# Altium schematic sheet PressurePulse_Pulse-PCB_Master.SchDoc
size B; SheetNumber: 1; SheetTotal: 15
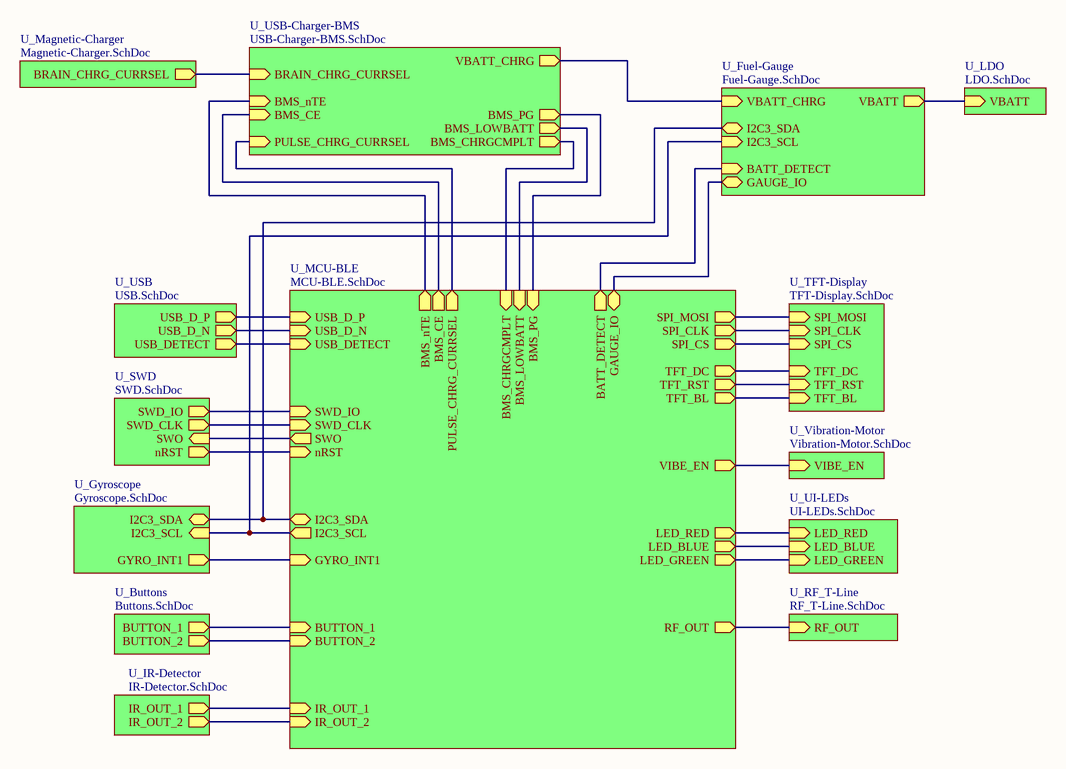
[diagram p0: PressurePulse_Pulse-PCB_Master.SchDoc]

## Sub-sheets
U_Buttons = Buttons.SchDoc: BUTTON_1 (out), BUTTON_2 (out)
U_Fuel-Gauge = Fuel-Gauge.SchDoc: I2C3_SCL (in), I2C3_SDA (bidir), GAUGE_IO (bidir), BATT_DETECT (in), VBATT (out), VBATT_CHRG (in)
U_Gyroscope = Gyroscope.SchDoc: I2C3_SDA (bidir), GYRO_INT1 (out), I2C3_SCL (in)
U_IR-Detector = IR-Detector.SchDoc: IR_OUT_1 (out), IR_OUT_2 (out)
U_LDO = LDO.SchDoc: VBATT (in)
U_Magnetic-Charger = Magnetic-Charger.SchDoc: BRAIN_CHRG_CURRSEL (out)
U_MCU-BLE = MCU-BLE.SchDoc: SWO (out), SWD_CLK (in), SWD_IO (in), nRST (in), USB_D_N (in), USB_D_P (in), I2C3_SCL (out), I2C3_SDA (bidir), BMS_PG (in), BMS_LOWBATT (in), BMS_CHRGCMPLT (in), BMS_nTE (out), BMS_CE (out), GAUGE_IO (bidir), BATT_DETECT (out), VIBE_EN (out), PULSE_CHRG_CURRSEL (out), GYRO_INT1 (in), USB_DETECT (in), SPI_CLK (out), SPI_MOSI (out), SPI_CS (out), TFT_RST (out), TFT_DC (out), TFT_BL (out), BUTTON_1 (in), BUTTON_2 (in), LED_RED (out), LED_BLUE (out), RF_OUT (out), LED_GREEN (out), IR_OUT_1 (in), IR_OUT_2 (in)
U_RF_T-Line = RF_T-Line.SchDoc: RF_OUT (in)
U_SWD = SWD.SchDoc: nRST (out), SWD_IO (out), SWD_CLK (out), SWO (in)
U_TFT-Display = TFT-Display.SchDoc: SPI_MOSI (in), SPI_CLK (in), SPI_CS (in), TFT_DC (in), TFT_RST (in), TFT_BL (in)
U_UI-LEDs = UI-LEDs.SchDoc: LED_RED (in), LED_BLUE (in), LED_GREEN (in)
U_USB = USB.SchDoc: USB_D_N (out), USB_D_P (out), USB_DETECT (out)
U_USB-Charger-BMS = USB-Charger-BMS.SchDoc: BMS_PG (out), BMS_LOWBATT (out), BMS_CHRGCMPLT (out), BMS_nTE (in), BMS_CE (in), PULSE_CHRG_CURRSEL (in), BRAIN_CHRG_CURRSEL (in), VBATT_CHRG (out)
U_Vibration-Motor = Vibration-Motor.SchDoc: VIBE_EN (in)

## Nets
(unnamed): sheet U_USB/USB_D_N, sheet U_MCU-BLE/USB_D_N
(unnamed): sheet U_USB/USB_D_P, sheet U_MCU-BLE/USB_D_P
(unnamed): sheet U_USB/USB_DETECT, sheet U_MCU-BLE/USB_DETECT
(unnamed): sheet U_USB-Charger-BMS/BMS_PG, sheet U_MCU-BLE/BMS_PG
(unnamed): sheet U_USB-Charger-BMS/BMS_LOWBATT, sheet U_MCU-BLE/BMS_LOWBATT
(unnamed): sheet U_USB-Charger-BMS/BMS_CHRGCMPLT, sheet U_MCU-BLE/BMS_CHRGCMPLT
(unnamed): sheet U_USB-Charger-BMS/BMS_nTE, sheet U_MCU-BLE/BMS_nTE
(unnamed): sheet U_USB-Charger-BMS/BMS_CE, sheet U_MCU-BLE/BMS_CE
(unnamed): sheet U_USB-Charger-BMS/PULSE_CHRG_CURRSEL, sheet U_MCU-BLE/PULSE_CHRG_CURRSEL
(unnamed): sheet U_USB-Charger-BMS/BRAIN_CHRG_CURRSEL, sheet U_Magnetic-Charger/BRAIN_CHRG_CURRSEL
(unnamed): sheet U_USB-Charger-BMS/VBATT_CHRG, sheet U_Fuel-Gauge/VBATT_CHRG
(unnamed): sheet U_Fuel-Gauge/I2C3_SCL, sheet U_MCU-BLE/I2C3_SCL, sheet U_Gyroscope/I2C3_SCL
(unnamed): sheet U_Fuel-Gauge/I2C3_SDA, sheet U_MCU-BLE/I2C3_SDA, sheet U_Gyroscope/I2C3_SDA
(unnamed): sheet U_Fuel-Gauge/GAUGE_IO, sheet U_MCU-BLE/GAUGE_IO
(unnamed): sheet U_Fuel-Gauge/BATT_DETECT, sheet U_MCU-BLE/BATT_DETECT
(unnamed): sheet U_Fuel-Gauge/VBATT, sheet U_LDO/VBATT
(unnamed): sheet U_SWD/nRST, sheet U_MCU-BLE/nRST
(unnamed): sheet U_SWD/SWD_IO, sheet U_MCU-BLE/SWD_IO
(unnamed): sheet U_SWD/SWD_CLK, sheet U_MCU-BLE/SWD_CLK
(unnamed): sheet U_SWD/SWO, sheet U_MCU-BLE/SWO
(unnamed): sheet U_MCU-BLE/VIBE_EN, sheet U_Vibration-Motor/VIBE_EN
(unnamed): sheet U_MCU-BLE/GYRO_INT1, sheet U_Gyroscope/GYRO_INT1
(unnamed): sheet U_MCU-BLE/SPI_CLK, sheet U_TFT-Display/SPI_CLK
(unnamed): sheet U_MCU-BLE/SPI_MOSI, sheet U_TFT-Display/SPI_MOSI
(unnamed): sheet U_MCU-BLE/SPI_CS, sheet U_TFT-Display/SPI_CS
(unnamed): sheet U_MCU-BLE/TFT_RST, sheet U_TFT-Display/TFT_RST
(unnamed): sheet U_MCU-BLE/TFT_DC, sheet U_TFT-Display/TFT_DC
(unnamed): sheet U_MCU-BLE/TFT_BL, sheet U_TFT-Display/TFT_BL
(unnamed): sheet U_MCU-BLE/BUTTON_1, sheet U_Buttons/BUTTON_1
(unnamed): sheet U_MCU-BLE/BUTTON_2, sheet U_Buttons/BUTTON_2
(unnamed): sheet U_MCU-BLE/LED_RED, sheet U_UI-LEDs/LED_RED
(unnamed): sheet U_MCU-BLE/LED_BLUE, sheet U_UI-LEDs/LED_BLUE
(unnamed): sheet U_MCU-BLE/RF_OUT, sheet U_RF_T-Line/RF_OUT
(unnamed): sheet U_MCU-BLE/LED_GREEN, sheet U_UI-LEDs/LED_GREEN
(unnamed): sheet U_MCU-BLE/IR_OUT_1, sheet U_IR-Detector/IR_OUT_1
(unnamed): sheet U_MCU-BLE/IR_OUT_2, sheet U_IR-Detector/IR_OUT_2